# Altium schematic sheet Sheet1.SchDoc
size B
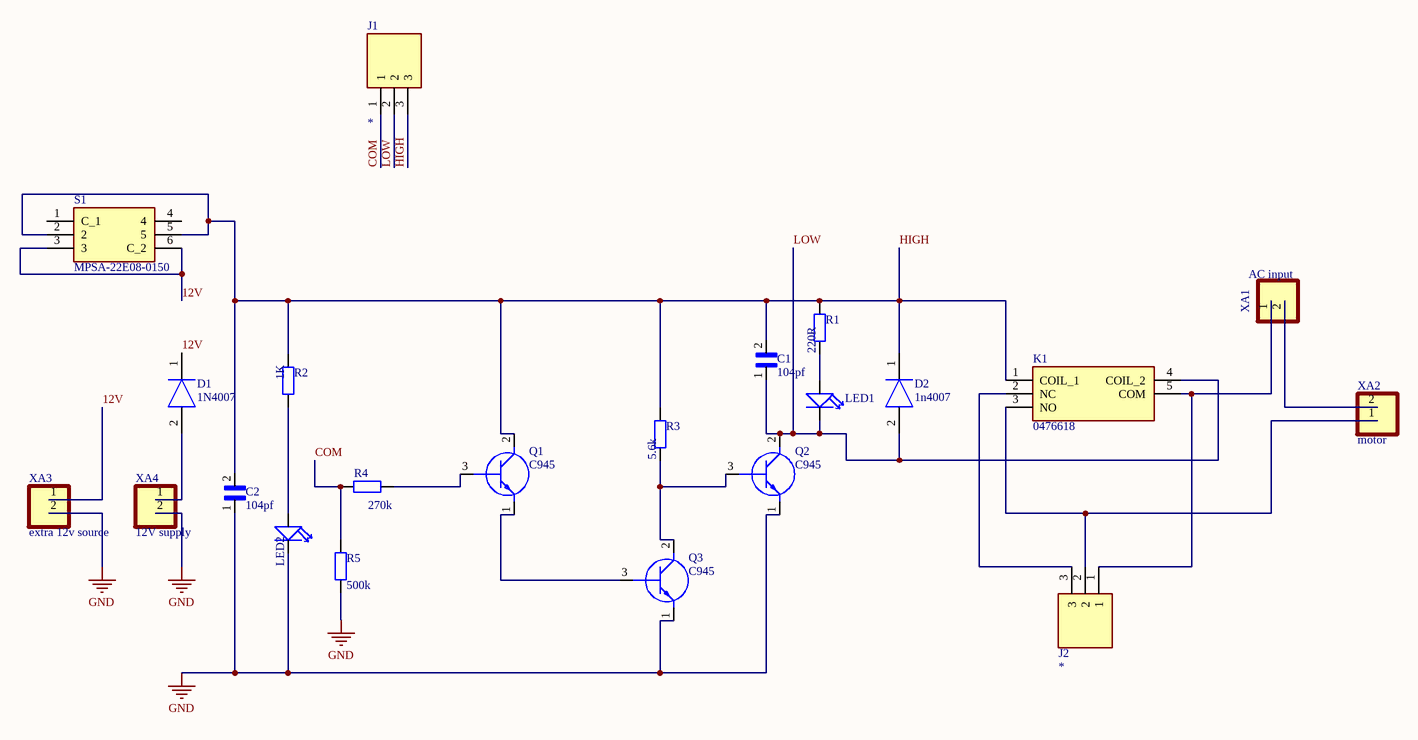
[diagram p0: Sheet1.SchDoc]

## Parts
C1  104pf  [CAP_DE21XSA100KN3AY02F]
C2  104pf  [CAP_DE21XSA100KN3AY02F]
D1  1N4007  [DIOAD1138W56L406D183]
D2  1n4007  [DIOAD1138W56L406D183]
J1  1776118-3  [TE_1776118-3]  (value not drawn)
J2  1776118-3  [TE_1776118-3]  (value not drawn)
K1  0476618  [0476618]
LED1  (no value)  [LED2-2.54-D10MM]
LED2  (no value)  [LED2-2.54-D10MM]
Q1  C945  [TO229P300X760X1364-3P]
Q2  C945  [TO229P300X760X1364-3P]
Q3  C945  [TO229P300X760X1364-3P]
R1  value 220R  [AXIAL-0.4]
R2  value 1K  [AXIAL-0.4]
R3  value 5.6k  [AXIAL-0.4]
R4  value 270k  [AXIAL-0.4]
R5  value 500k  [AXIAL-0.4]
S1  MPSA-22E08-0150  [MPSA22E080150]
XA1  AC input  [PHOENIX_MKDS1/2-3.81]
XA2  motor  [PHOENIX_MKDS1/2-3.81]
XA3  extra 12v source  [PHOENIX_MKDS1/2-3.81]
XA4  12V supply  [PHOENIX_MKDS1/2-3.81]

## Nets
GND: C2.1 LED2.NEG Q2.1(E) Q3.1(E) R5.1 XA3.2 XA4.2
12V: D1.1(K) S1.3 S1.6(C_2) XA3.1
COM: J1.1 R4.1 R5.2
HIGH: C1.2 C2.2 D2.1(K) J1.3 K1.1(COIL_1) Q1.2(C) R1.2 R2.2 R3.2 S1.2 S1.5
LOW: C1.1 D2.2(A) J1.2 K1.4(COIL_2) LED1.NEG Q2.2(C)
NetD1_2: D1.2(A) XA4.1
NetJ2_1: J2.1 K1.5(COM) XA1.1
NetJ2_2: J2.2 K1.3(NO) XA2.1
NetJ2_3: J2.3 K1.2(NC)
NetLED1_POS: LED1.POS R1.1
NetLED2_POS: LED2.POS R2.1
NetQ1_1: Q1.1(E) Q3.3(B)
NetQ1_3: Q1.3(B) R4.2
NetQ2_3: Q2.3(B) Q3.2(C) R3.1
NetXA1_2: XA1.2 XA2.2

Not connected (* = marked no-connect by the designer): S1 1(C_1) 4

## Library data of the parts
C1 C2 = DE21XSA100KN3AY02F: Package: None; Price: None; Value: *; MP: DE21XSA100KN3AY02F; Availability: Unavailable
D1 D2 = 1N4678__DO35_: Diode; Manufacturer_Name: Microsemi Corporation; Manufacturer_Part_Number: 1N4678 (DO35); Datasheet Link: https://www.microsemi.com/document-portal/doc_download/5827-1n4678-4717-datasheet
J1 J2 = 1776118-3: Conn Terminal Block F 3 POS 5mm Solder ST Thru-Hole Package; Number_of_Positions: 3; Centerline_Pitch: 5 mm[.197 in]; MF: TE Connectivity; Value: *; MP: 1776118-3; SnapEDA_Link: https://www.snapeda.com/parts/1776118-3/TE%20Connectivity%20AMP%20Connectors/view-part/2375684/?ref=snap; Availability: Unavailable; Package: None; TE_purchase_URL: https://www.te.com/usa-en/product-1776118-3.html?te_bu=Cor&te_type=disp&te_campaign=seda_glo_cor-seda-global-disp-prtnr-fy19-seda-model-bom-cta_sma-317_1&elqCampaignId=32493; Price: None; EU_RoHS_Compliance: Compliant with Exemptions; Comment_1: *
K1 = 0476618: Relay or Contactor; Manufacturer_Name: RS Components; Datasheet Link: https://docs-emea.rs-online.com/webdocs/1583/0900766b81583163.pdf; Height: 15mm; Manufacturer_Part_Number: 0476618
LED1 LED2 = DIP-LED-GREEN-VAPOROUS-GREEN-10MM(2P-D10MM): DIP LED Green-Vaporous Green-10mm; MF: Chengguangxing; MP: G1004DC; Package: None; Value: *; SnapEDA_Link: https://www.snapeda.com/parts/G1004DC/Chengguangxing/view-part/106403/?ref=snap; Availability: Unavailable; Price: None
Q1-Q3 = BD139G: Transistor BJT NPN; Manufacturer_Name: ON Semiconductor; Datasheet Link: http://www.onsemi.com/pub/Collateral/BD135-D.PDF; Height: 3mm; Manufacturer_Part_Number: BD139G; Mouser Part Number: 863-BD139G; Mouser Price/Stock: https://www.mouser.co.uk/ProductDetail/ON-Semiconductor/BD139G?qs=vNc2DXHODiLIqGggNMT6cg%3D%3D; Arrow Part Number: BD139G; Arrow Price/Stock: https://www.arrow.com/en/products/bd139g/on-semiconductor
R1-R5 = Res2: Resistor; Published: 8-Jun-2000; LatestRevisionDate: 17-Jul-2002; LatestRevisionNote: Re-released for DXP Platform.; PackageReference: AXIAL-0.4; Publisher: Altium Limited; PackageDescription: Axial Device, Thru-Hole; 2 Leads; 0.4 in Pin Spacing
S1 = MPSA-22E08-0150: Switch; Manufacturer_Name: KNITTER-SWITCH; Datasheet Link: http://www.knitter-switch.com/eng/Series/17?search=MPSA-22E08-0150; Height: 8mm; Manufacturer_Part_Number: MPSA-22E08-0150
XA1-XA4 = MKDS1/2-3.81: 2 Position Wire to Board Terminal Block Horizontal with Board 0.150 _3.81mm_ Through Hole; MF: Phoenix Contact; Package: None; Price: None; SnapEDA_Link: https://www.snapeda.com/parts/MKDS%201/%202-3.81/Phoenix%20Contact/view-part/114562/?ref=snap; Availability: Unavailable; Value: *; MP: MKDS 1/ 2-3.81